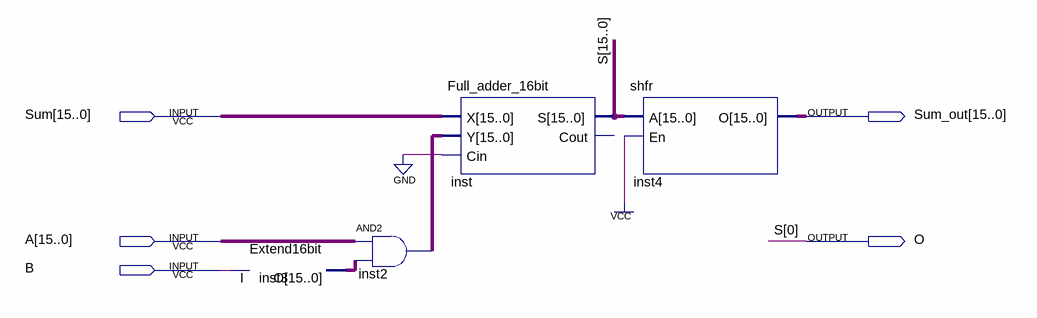
[diagram p0: schematic sheet]
// Quartus schematic mult16_1.bdf as structural Verilog: 4 symbols, 5 pins
module mult16_1 (
  input  [15:0] Sum,
  input  [15:0] A,
  input  B,
  output [15:0] Sum_out,
  output O
);

  wire [15:0] inst2_out, inst3_o;
  wire [15:1] S;

  Extend16bit inst3 (.I(B), .O(inst3_o));
  assign inst2_out = A & inst3_o;  // AND2 inst2, 16 bits wide
  Full_adder_16bit inst (.X(Sum), .Y(inst2_out), .Cin(1'b0), .S({S, O}));  // open: Cout
  shfr inst4 (.A({S, O}), .En(1'b1), .O(Sum_out));

  // Other names for the same wires on the sheet: S[0] = O
endmodule
